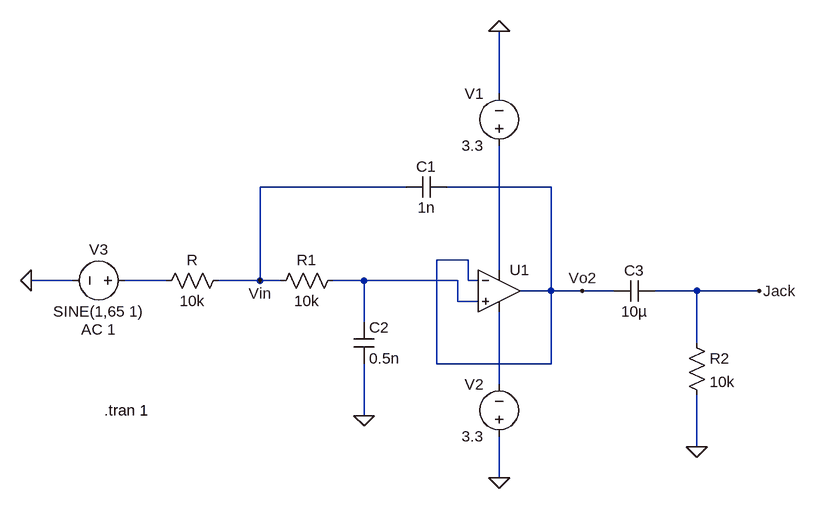
[diagram p0: schematic Salida.asc]
Salida.asc, the LTspice schematic file:
Version 4.1
SHEET 1 880 680
WIRE 288 -144 288 -240
WIRE 144 0 -80 0
WIRE 368 0 208 0
WIRE 240 112 192 112
WIRE 288 128 288 -64
WIRE -368 144 -432 144
WIRE -224 144 -288 144
WIRE -80 144 -80 0
WIRE -80 144 -144 144
WIRE -48 144 -80 144
WIRE 80 144 32 144
WIRE 224 144 80 144
WIRE 240 144 240 112
WIRE 256 144 240 144
WIRE 368 160 368 0
WIRE 368 160 320 160
WIRE 416 160 368 160
WIRE 464 160 416 160
WIRE 592 160 528 160
WIRE 688 160 592 160
WIRE 224 176 224 144
WIRE 256 176 224 176
WIRE 80 208 80 144
WIRE 592 240 592 160
WIRE 192 272 192 112
WIRE 368 272 368 160
WIRE 368 272 192 272
WIRE 288 304 288 192
WIRE 80 352 80 272
WIRE 592 400 592 320
WIRE 288 448 288 384
FLAG 80 352 0
FLAG 416 160 Vo2
FLAG 288 448 0
FLAG 288 -240 0
FLAG -432 144 0
FLAG -80 144 Vin
FLAG 592 400 0
FLAG 688 160 Jack
SYMBOL cap 64 208 R0
SYMATTR InstName C2
SYMATTR Value 0.5n
SYMBOL res -128 128 R90
WINDOW 0 0 56 VBottom 2
WINDOW 3 32 56 VTop 2
SYMATTR InstName R
SYMATTR Value 10k
SYMBOL res 48 128 R90
WINDOW 0 0 56 VBottom 2
WINDOW 3 32 56 VTop 2
SYMATTR InstName R1
SYMATTR Value 10k
SYMBOL cap 208 -16 R90
WINDOW 0 0 32 VBottom 2
WINDOW 3 32 32 VTop 2
SYMATTR InstName C1
SYMATTR Value 1n
SYMBOL OpAmps\\UniversalOpAmp2 288 160 R0
SYMATTR InstName U1
SYMBOL voltage 288 -48 R180
WINDOW 0 24 96 Left 2
WINDOW 3 24 16 Left 2
WINDOW 123 0 0 Left 0
WINDOW 39 0 0 Left 0
SYMATTR InstName V1
SYMATTR Value 3.3
SYMBOL voltage 288 400 R180
WINDOW 0 24 96 Left 2
WINDOW 3 24 16 Left 2
WINDOW 123 0 0 Left 0
WINDOW 39 0 0 Left 0
SYMATTR InstName V2
SYMATTR Value 3.3
SYMBOL voltage -272 144 R90
WINDOW 0 -32 56 VBottom 2
WINDOW 3 32 56 VTop 2
WINDOW 123 60 56 VTop 2
WINDOW 39 0 0 Left 0
SYMATTR InstName V3
SYMATTR Value SINE(1,65 1)
SYMATTR Value2 AC 1
SYMBOL cap 528 144 R90
WINDOW 0 0 32 VBottom 2
WINDOW 3 32 32 VTop 2
SYMATTR InstName C3
SYMATTR Value 10µ
SYMBOL res 576 224 R0
SYMATTR InstName R2
SYMATTR Value 10k
TEXT -320 344 Left 2 !.tran 1

The netlist it stands for:
* Salida.asc
C2 N003 0 0.5n
R Vin N002 10k
R1 N003 Vin 10k
C1 Vo2 Vin 1n
X§U1 N003 Vo2 N001 N004 Vo2 level2 Avol=1Meg GBW=10Meg Slew=10Meg Ilimit=25m Rail=0 Vos=0 En=0 Enk=0 In=0 Ink=0 Rin=500Meg  ; pins In+ In- V+ V- OUT
V1 N001 0 3.3
V2 0 N004 3.3
V3 N002 0 SINE(1,65 1) AC 1
C3 Jack Vo2 10µ
R2 Jack 0 10k
.tran 1
.lib UniversalOpAmp2.lib
.backanno
.end